# EasyEDA Pro project ProPrj_New Project_2026-07-15_23-14-34_2026-07-27.epro, board PCB1
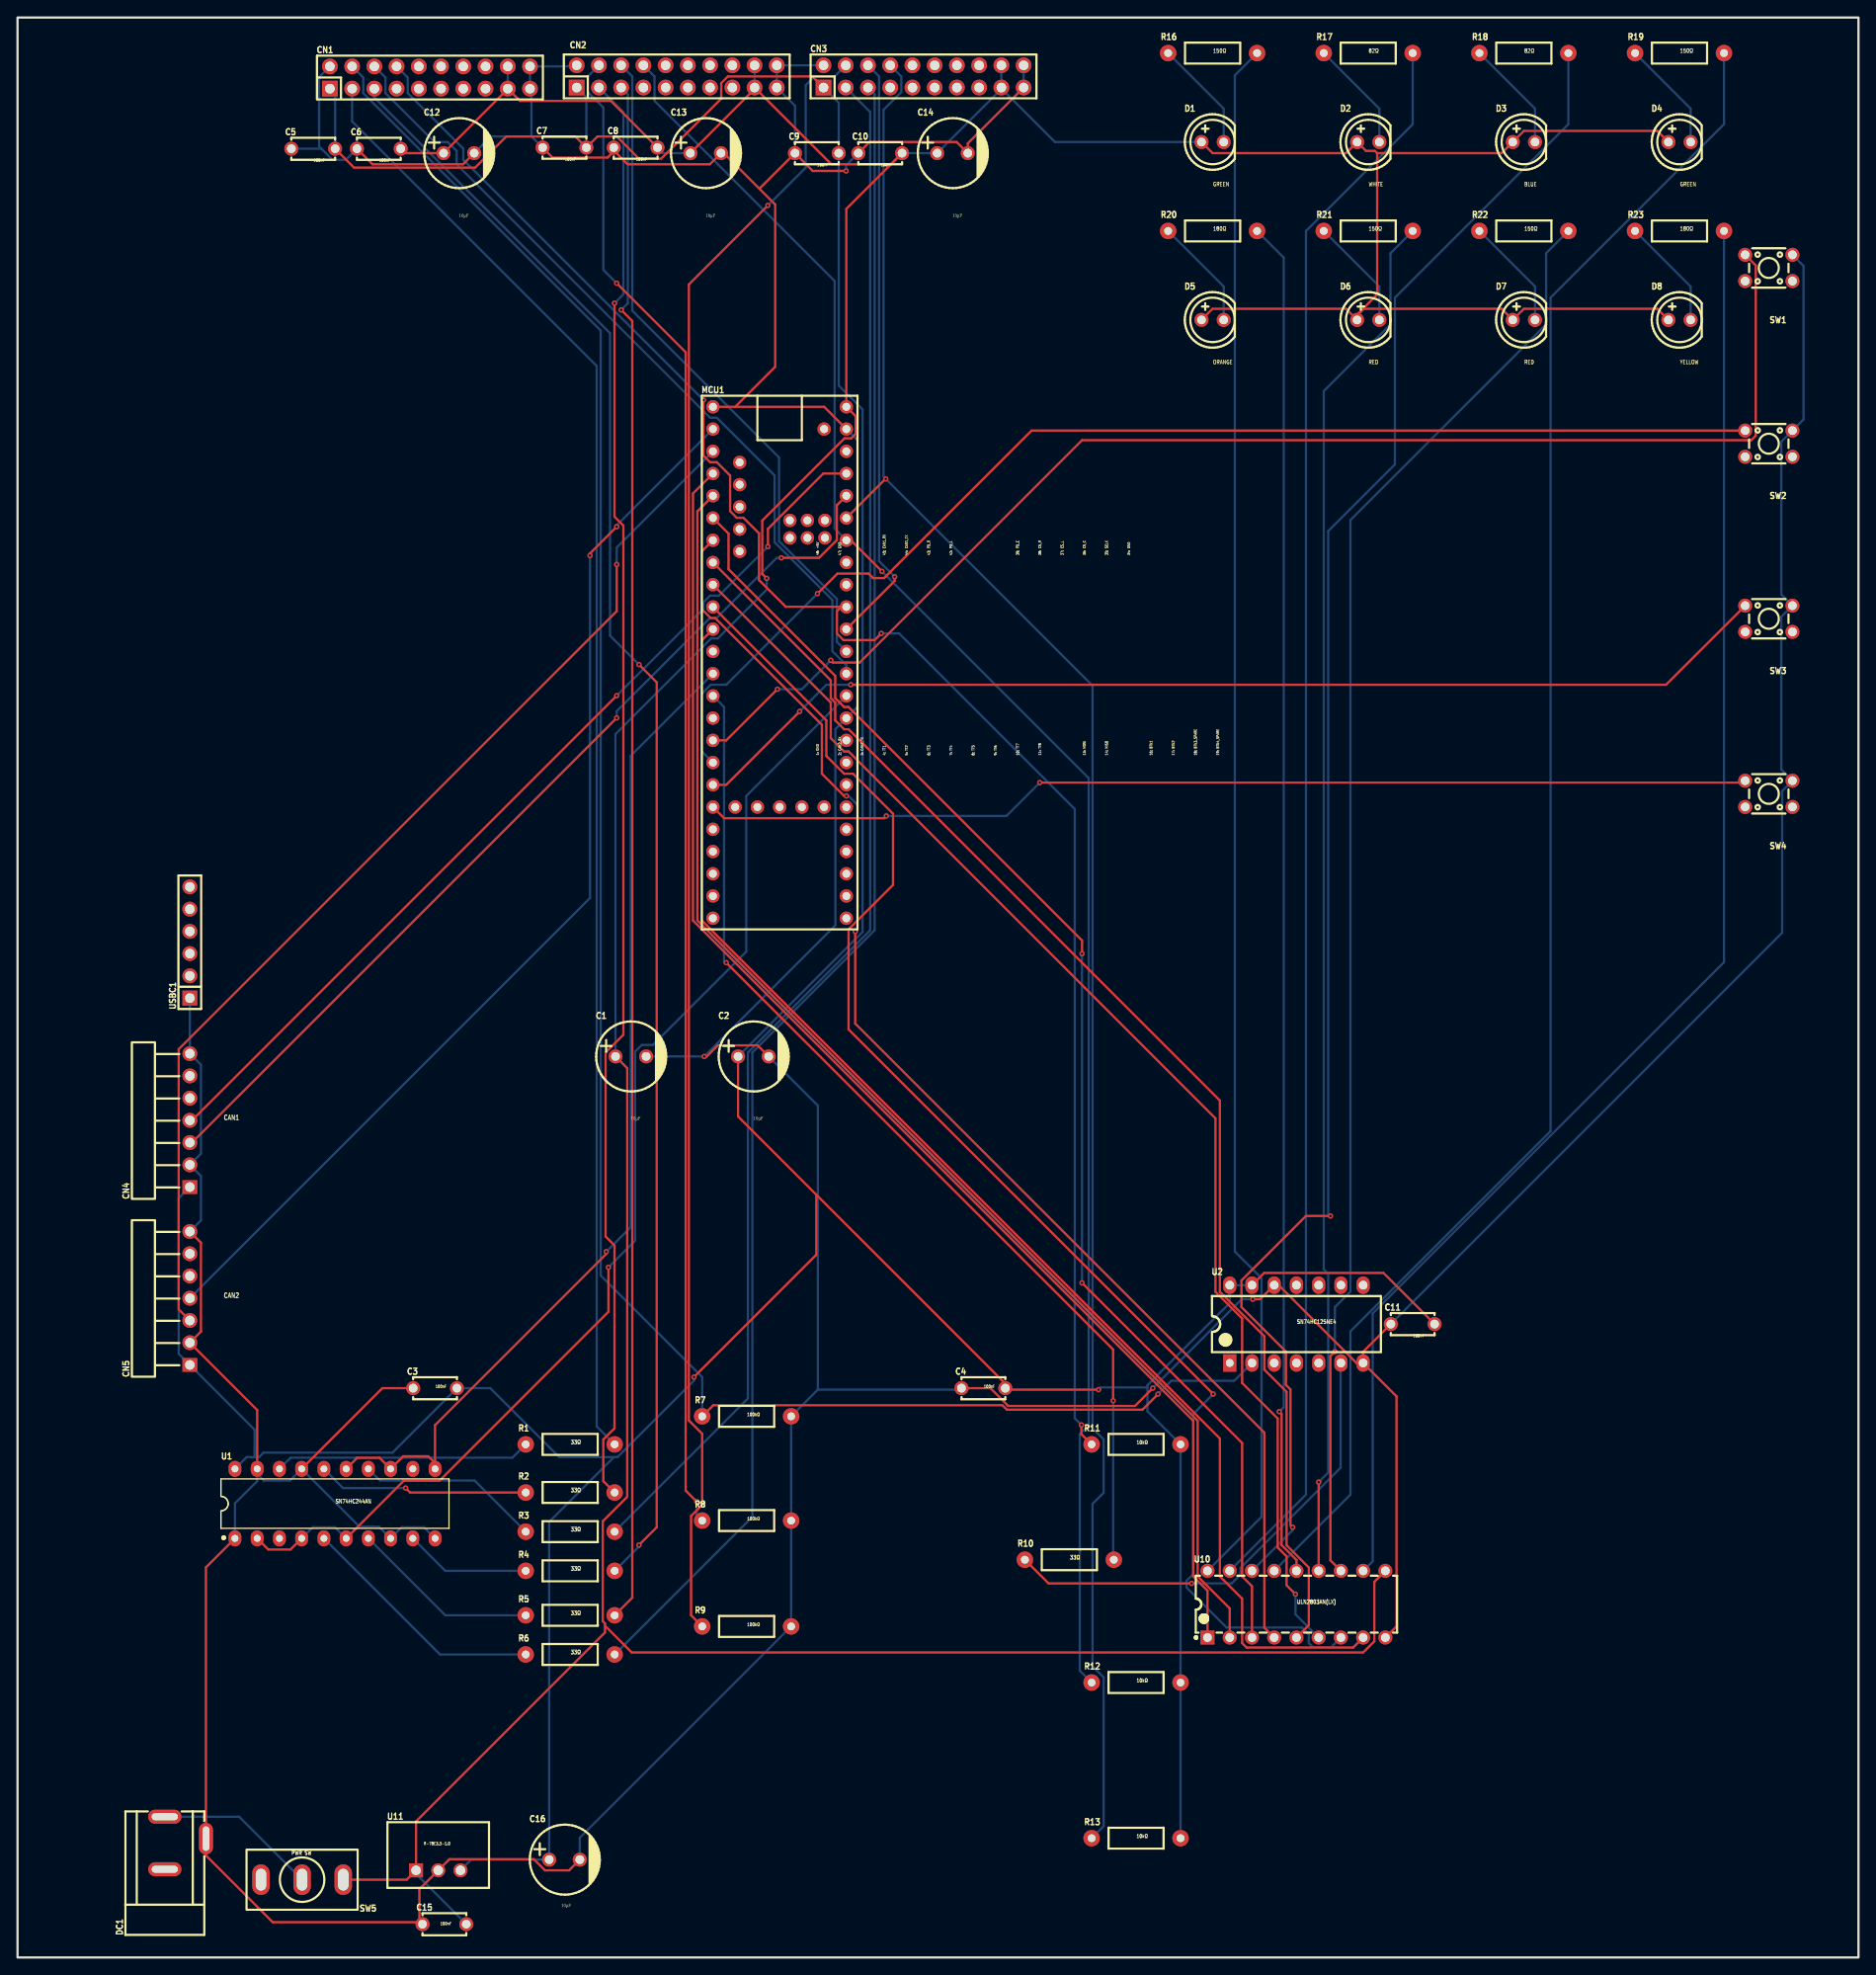
[diagram p7: board, top side]
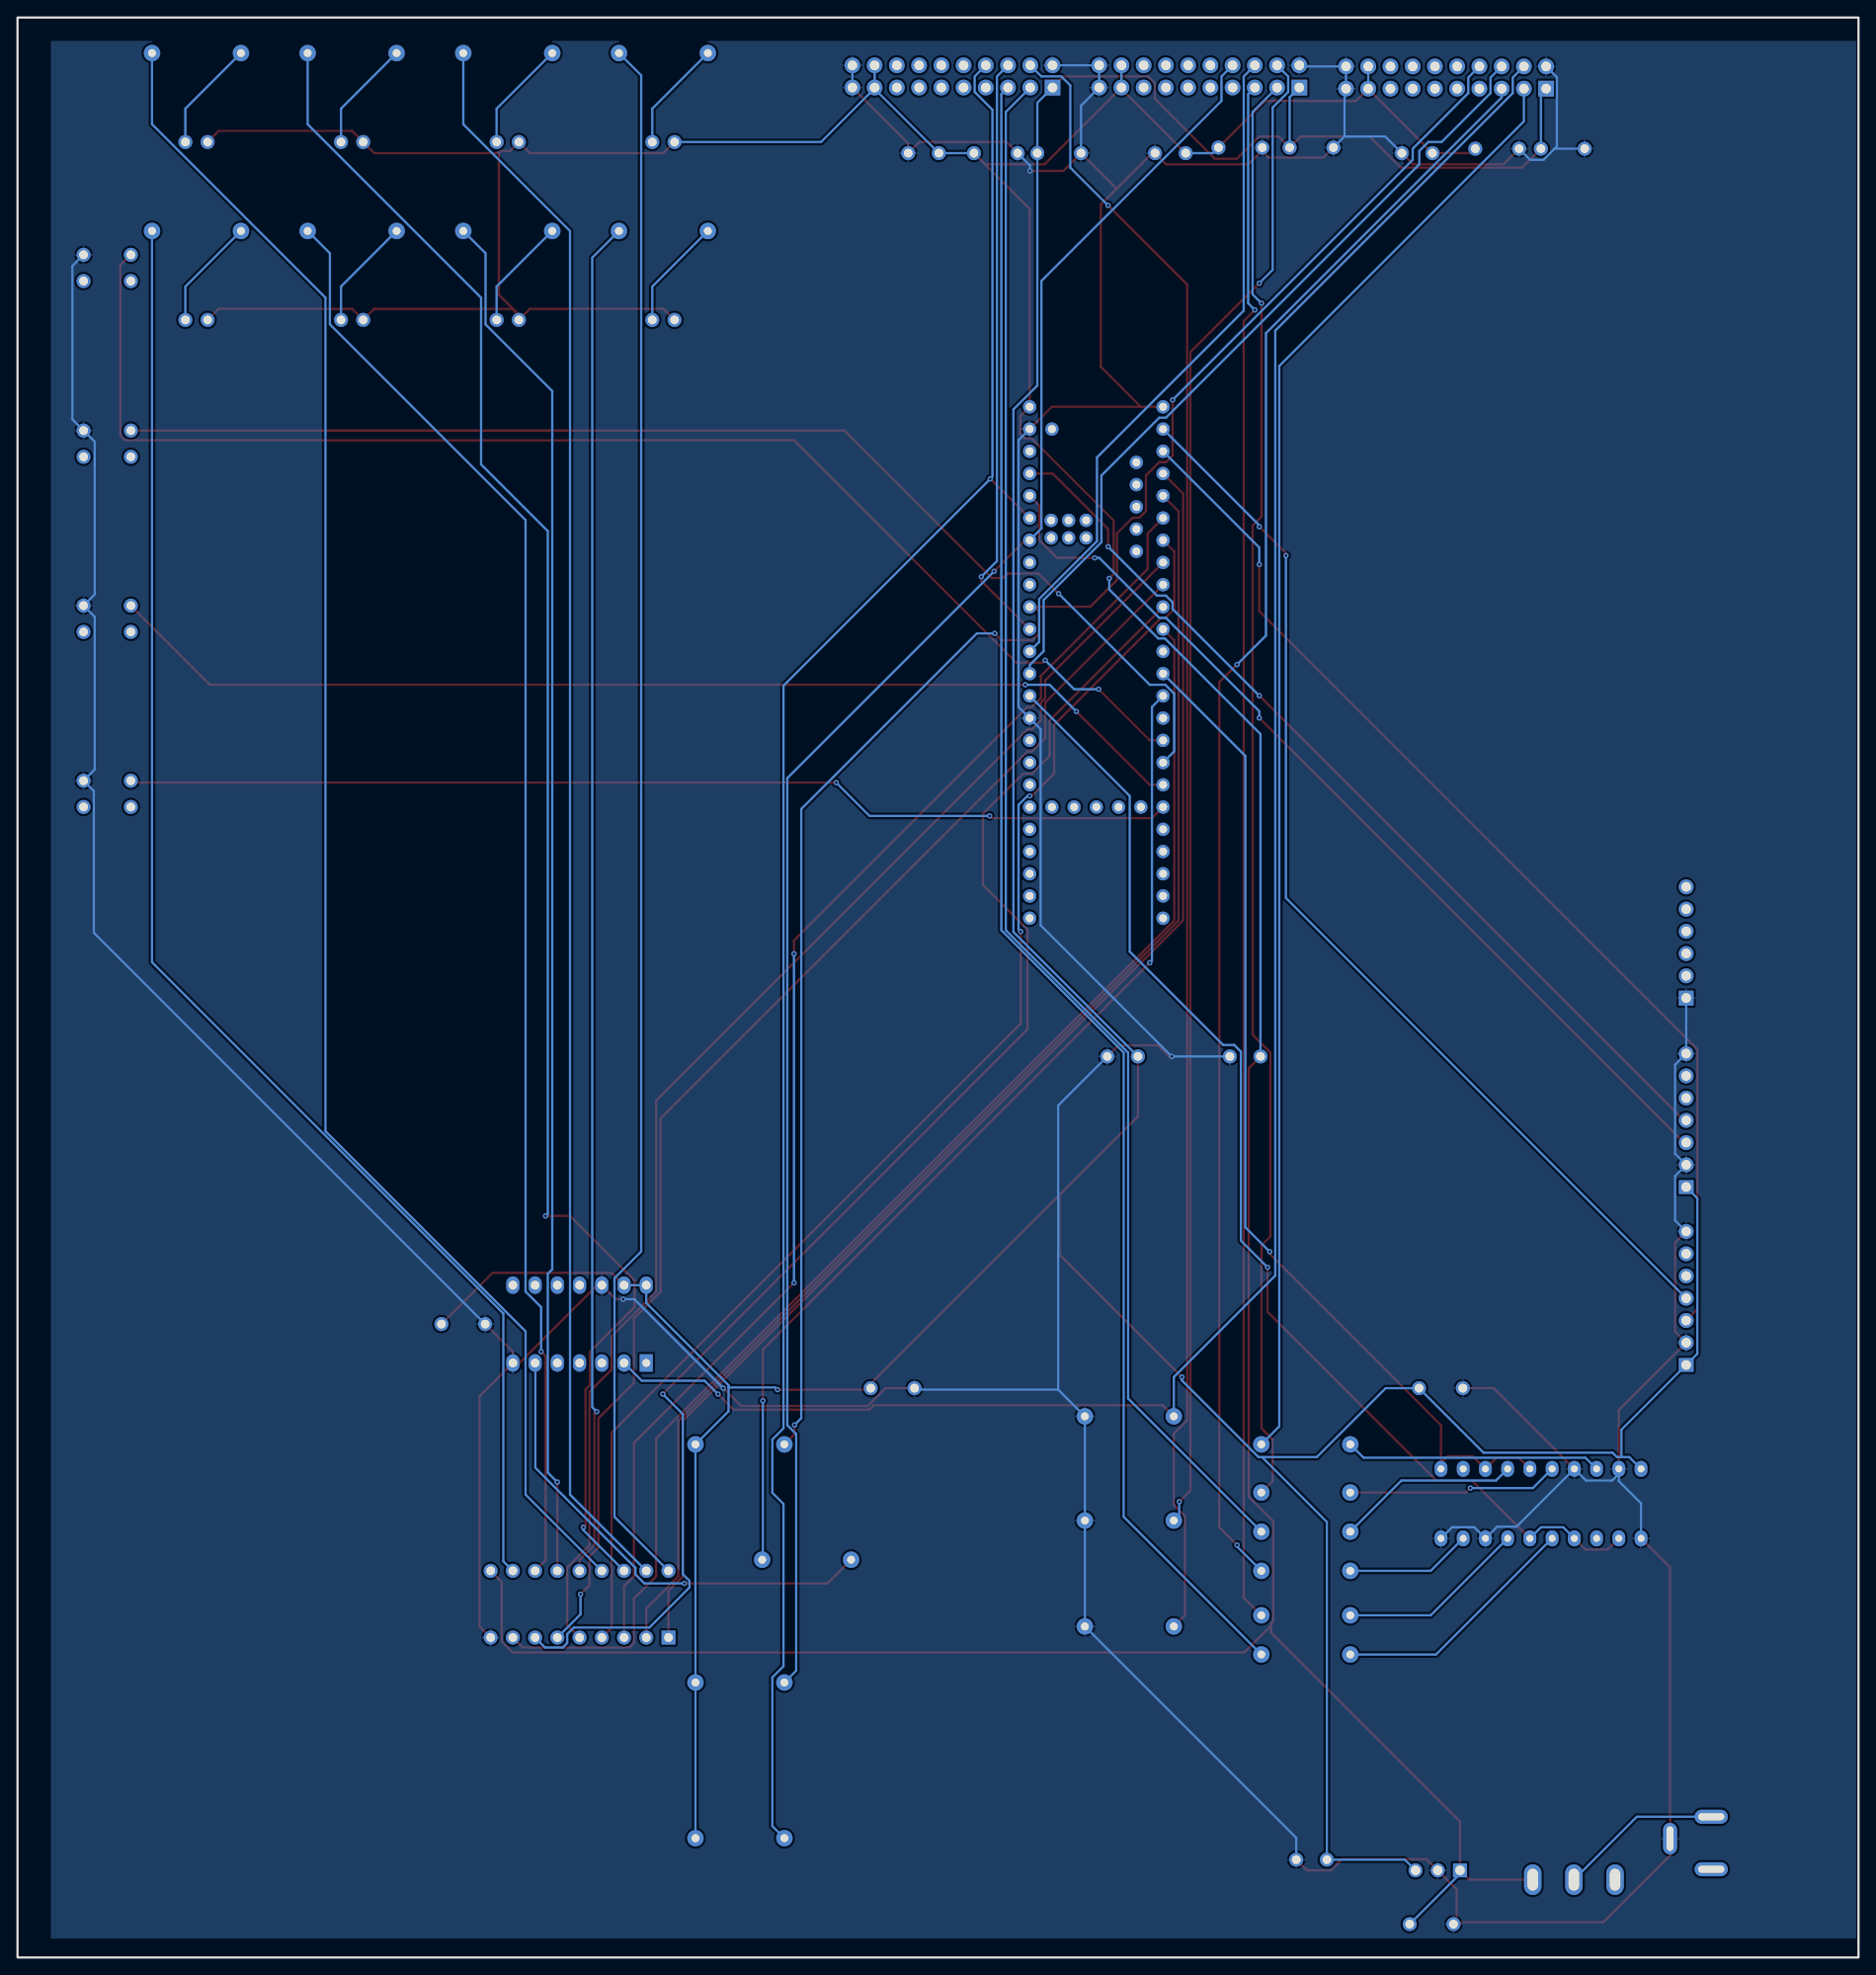
[diagram p8: board, bottom side, seen from below]

Outline 210.31 x 221.62 mm; copper layers: Top Layer, Bottom Layer. Coordinates in mm from the lower left corner of the outline.
Outline path: rectangle 0,221.62 210.31,0
Stack: Top Layer 0.035mm / Dielectric1 1.51mm FR4 er 4.5 / Bottom Layer 0.035mm

## Design rules (mm)
spacing copperThickness1oz (default): track to track 0.102, other pairs 0.152 to 0.3
spacing copperThickness2oz: track to track 0.203, other pairs 0.152 to 0.3
track width copperThickness1oz (default): min 0.127, default 0.254, max 2.54
track width copperThickness2oz: min 0.203, default 0.254, max 2.54
differential pair differentialPair (default): width min 0.127, default 0.254, max 2.54; gap min 0.152, default 0.152
net GND uses copperRegion

## Placement (name value [footprint] x y rotation side)
C1  10µF  [CAP-TH_BD8.0-P3.50-D0.6-FD]  70.06 102.93 0 top
C2  10µF  [CAP-TH_BD8.0-P3.50-D0.6-FD]  84.06 102.93 0 top
C3  100nF  [CAP-TH_L5.0-W2.5-P5.00-D1.0]  47.7 65.04 0 top
C4  100nF  [CAP-TH_L5.0-W2.5-P5.00-D1.0]  110.34 65.04 0 top
C5  100nF  [CAP-TH_L5.0-W2.5-P5.00-D1.0]  33.78 206.63 0 top
C6  100nF  [CAP-TH_L5.0-W2.5-P5.00-D1.0]  41.27 206.63 0 top
C7  100nF  [CAP-TH_L5.0-W2.5-P5.00-D1.0]  62.48 206.76 0 top
C8  100nF  [CAP-TH_L5.0-W2.5-P5.00-D1.0]  70.61 206.76 0 top
C9  100nF  [CAP-TH_L5.0-W2.5-P5.00-D1.0]  91.31 206.12 0 top
C10  100nF  [CAP-TH_L5.0-W2.5-P5.00-D1.0]  98.55 206.12 0 top
C11  100nF  [CAP-TH_L5.0-W2.5-P5.00-D1.0]  159.38 72.36 0 top
C12  10µF  [CAP-TH_BD8.0-P3.50-D0.6-FD]  50.42 206.12 0 top
C13  10µF  [CAP-TH_BD8.0-P3.50-D0.6-FD]  78.61 206.12 0 top
C14  10µF  [CAP-TH_BD8.0-P3.50-D0.6-FD]  106.81 206.12 0 top
C15  100nF  [CAP-TH_L5.0-W2.5-P5.00-D1.0]  48.77 3.81 0 top
C16  10µF  [CAP-TH_BD8.0-P3.50-D0.6-FD]  62.48 11.18 0 top
CN1  2.54-2*10P-CON20  [HDR-TH_20P-P2.54-V-F-R2-C10-S2.54]  47.12 214.76 0 top
CN2  2.54-2*10P-CON20  [HDR-TH_20P-P2.54-V-F-R2-C10-S2.54]  75.31 214.88 0 top
CN3  2.54-2*10P-CON20  [HDR-TH_20P-P2.54-V-F-R2-C10-S2.54]  103.5 214.88 0 top
CN4  1*7pin排间距2.54mm  [CONN-TH_7P-P2.54_C9900012194]  19.69 95.63 90 top
CN5  1*7pin排间距2.54mm  [CONN-TH_7P-P2.54_C9900012194]  19.69 75.31 90 top
D1  GREEN (left turn)  [LED-TH_BD5.0-P2.54-FD]  136.53 207.39 0 top
D2  WHITE (headlight)  [LED-TH_BD5.0-P2.54-FD]  154.31 207.39 0 top
D3  BLUE (high beam)  [LED-TH_BD5.0-P2.54-FD]  172.09 207.39 0 top
D4  GREEN (right turn)  [LED-TH_BD5.0-P2.54-FD]  189.87 207.39 0 top
D5  ORANGE (MIL/CEL)  [LED-TH_BD5.0-P2.54-FD]  136.53 187.07 0 top
D6  RED (parking brake)  [LED-TH_BD5.0-P2.54-FD]  154.31 187.07 0 top
D7  RED (oil)  [LED-TH_BD5.0-P2.54-FD]  172.09 187.07 0 top
D8  YELLOW (fog lights)  [LED-TH_BD5.0-P2.54-FD]  189.87 187.07 0 top
DC1  DC-005-5.5*2.5  [DC-IN-TH_DC-005-2]  19.18 13.08 90 top
MCU1  TEENSY41  [COMM-TH_L60.1-W17.8-P2.54]  87.06 147.93 0 top
R1  33Ω  [R_AXIAL-0.4]  63.14 58.62 0 top
R2  33Ω  [R_AXIAL-0.4]  63.14 53.12 0 top
R3  33Ω  [R_AXIAL-0.4]  63.14 48.64 0 top
R4  33Ω  [R_AXIAL-0.4]  63.14 44.17 0 top
R5  33Ω  [R_AXIAL-0.4]  63.14 39.09 0 top
R6  33Ω  [R_AXIAL-0.4]  63.14 34.62 0 top
R7  100kΩ  [R_AXIAL-0.4]  83.3 61.82 0 top
R8  100kΩ  [R_AXIAL-0.4]  83.3 49.91 0 top
R9  100kΩ  [R_AXIAL-0.4]  83.3 37.82 0 top
R10  33Ω  [R_AXIAL-0.4]  120.16 45.44 0 top
R11  10kΩ  [R_AXIAL-0.4]  127.78 58.62 0 top
R12  10kΩ  [R_AXIAL-0.4]  127.78 31.41 0 top
R13  10kΩ  [R_AXIAL-0.4]  127.78 13.63 0 top
R16  150Ω  [R_AXIAL-0.4]  136.53 217.55 0 top
R17  82Ω  [R_AXIAL-0.4]  154.31 217.55 0 top
R18  82Ω  [R_AXIAL-0.4]  172.09 217.55 0 top
R19  150Ω  [R_AXIAL-0.4]  189.87 217.55 0 top
R20  180Ω  [R_AXIAL-0.4]  136.53 197.23 0 top
R21  150Ω  [R_AXIAL-0.4]  154.31 197.23 0 top
R22  150Ω  [R_AXIAL-0.4]  172.09 197.23 0 top
R23  180Ω  [R_AXIAL-0.4]  189.87 197.23 0 top
SW1  TACT SW  [SW-TH_4P-L4.5-W4.5-P3.00-LS5.4]  200.07 193.01 0 top
SW2  TACT SW  [SW-TH_4P-L4.5-W4.5-P3.00-LS5.4]  200.07 172.93 0 top
SW3  TACT SW  [SW-TH_4P-L4.5-W4.5-P3.00-LS5.4]  200.07 152.93 0 top
SW4  TACT SW  [SW-TH_4P-L4.5-W4.5-P3.00-LS5.4]  200.07 132.93 0 top
SW5  100SP1T1B1M1QEH  [SW-TH_L12.7-W6.9-P4.70_TOGGLESWITCH7102]  32.51 8.89 180 top
U1  SN74HC244AN  [PDIP-20_L25.9-W6.6-P2.54-LS7.9-BL]  36.27 51.85 0 top
U2  SN74HC125NE4  [PDIP-14_L19.3-W6.4-P2.54-LS9.0-BL]  146.1 72.36 0 top
U10  ULN2803AN(LX)  [DIP-18_L23.0-W6.5-P2.54-LS7.6-BL]  146.1 40.36 0 top
U11  R-78E3.3-1.0  [PWRM-TH_R-78EXX-1.0]  48.06 9.96 0 top
USBC1  2.54-1*6-BLUE  [HDR-TH_6P-P2.54-V-M_BLUE]  19.69 115.95 90 top

## Footprints (pads in the part's own frame, mm; a bottom-side part is the same pattern mirrored in y, then rotated)
CAP-TH_BD8.0-P3.50-D0.6-FD
  round 1.6 hole 1: 1(-1.75,0) 2(1.75,0)
CAP-TH_L5.0-W2.5-P5.00-D1.0
  round 1.6 hole 1: 1(-2.5,0) 2(2.5,0)
COMM-TH_L60.1-W17.8-P2.54
  round 1.524 hole 0.914: 1(-7.62,29.21) 2(-7.62,26.67) 3(-7.62,24.13) 4(-7.62,21.59) 5(-7.62,19.05) 6(-7.62,16.51) 7(-7.62,13.97) 8(-7.62,11.43) 9(-7.62,8.89) 10(-7.62,6.35) 11(-7.62,3.81) 12(-7.62,1.27) 13(-7.62,-1.27) 14(-7.62,-3.81) 15(-7.62,-6.35) 16(-7.62,-8.89) 17(-7.62,-11.43) 18(-7.62,-13.97) 19(-7.62,-16.51) 20(-7.62,-19.05) 21(-7.62,-21.59) 22(-7.62,-24.13) 23(-7.62,-26.67) 24(-7.62,-29.21) 25(7.62,-29.21) 26(7.62,-26.67) 27(7.62,-24.13) 28(7.62,-21.59) 29(7.62,-19.05) 30(7.62,-16.51) 31(7.62,-13.97) 32(7.62,-11.43) 33(7.62,-8.89) 34(7.62,-6.35) 35(7.62,-3.81) 36(7.62,-1.27) 37(7.62,1.27) 38(7.62,3.81) 39(7.62,6.35) 40(7.62,8.89) 41(7.62,11.43) 42(7.62,13.97) 43(7.62,16.51) 44(7.62,19.05) 45(7.62,21.59) 46(7.62,24.13) 47(7.62,26.67) 48(7.62,29.21) 49(-4.57,22.86) 50(-4.57,20.32) 51(-4.57,17.78) 52(-4.57,15.24) 53(-4.57,12.7) 54(-5.08,-16.51) 55(-2.54,-16.51) 56(0,-16.51) 57(2.54,-16.51) 58(5.08,-16.51) 59(5.17,16.24) 60(5.17,14.24) 61(3.17,16.24) 62(3.17,14.24) 63(1.17,16.24) 64(1.17,14.24) 65(5.08,26.67)
CONN-TH_7P-P2.54_C9900012194
  rect 1.575x1.7 hole 1.1: 1(-7.62,0)
  round 1.7 hole 1.1: 2(-5.08,0) 3(-2.54,0) 4(0,0) 5(2.54,0) 6(5.08,0) 7(7.62,0)
DC-IN-TH_DC-005-2
  oval 1.6x3.8 hole 0.8x3: 1(2.999,2.35) 2(-3,2.35)
  oval 3.6x1.6 hole 2.8x0.8: 3(0.5,-2.35)
DIP-18_L23.0-W6.5-P2.54-LS7.6-BL
  rect 1.6x1.6 hole 1: 1(-10.16,-3.81)
  round 1.6 hole 1: 2(-7.62,-3.81) 3(-5.08,-3.81) 4(-2.54,-3.81) 5(0,-3.81) 6(2.54,-3.81) 7(5.08,-3.81) 8(7.62,-3.81) 9(10.16,-3.81) 10(10.16,3.81) 11(7.62,3.81) 12(5.08,3.81) 13(2.54,3.81) 14(0,3.81) 15(-2.54,3.81) 16(-5.08,3.81) 17(-7.62,3.81) 18(-10.16,3.81)
HDR-TH_6P-P2.54-V-M_BLUE
  rect 1.7x1.7 hole 1.1: 1(-6.35,0)
  round 1.7 hole 1.1: 2(-3.81,0) 3(-1.27,0) 4(1.27,0) 5(3.81,0) 6(6.35,0)
HDR-TH_20P-P2.54-V-F-R2-C10-S2.54
  rect 1.8x1.8 hole 1.1: 1(-11.43,-1.27)
  round 1.8 hole 1.1: 2(-11.43,1.27) 3(-8.89,-1.27) 4(-8.89,1.27) 5(-6.35,-1.27) 6(-6.35,1.27) 7(-3.81,-1.27) 8(-3.81,1.27) 9(-1.27,-1.27) 10(-1.27,1.27) 11(1.27,-1.27) 12(1.27,1.27) 13(3.81,-1.27) 14(3.81,1.27) 15(6.35,-1.27) 16(6.35,1.27) 17(8.89,-1.27) 18(8.89,1.27) 19(11.43,-1.27) 20(11.43,1.27)
LED-TH_BD5.0-P2.54-FD
  round 1.6 hole 1: 1(-1.27,0) 2(1.27,0)
PDIP-14_L19.3-W6.4-P2.54-LS9.0-BL
  rect 1.5x2 hole 0.9: 1(-7.62,-4.445)
  oval 1.5x2 hole 1: 2(-5.08,-4.445) 3(-2.54,-4.445) 4(0,-4.445) 5(2.54,-4.445) 6(5.08,-4.445) 7(7.62,-4.445) 8(7.62,4.445) 9(5.08,4.445) 10(2.54,4.445) 11(0,4.445) 12(-2.54,4.445) 13(-5.08,4.445) 14(-7.62,4.445)
PDIP-20_L25.9-W6.6-P2.54-LS7.9-BL
  oval 1.462x1.827 hole 0.8: 1(-11.43,-3.97) 2(-8.89,-3.97) 3(-6.35,-3.97) 4(-3.81,-3.97) 5(-1.27,-3.97) 6(1.27,-3.97) 7(3.81,-3.97) 8(6.35,-3.97) 9(8.89,-3.97) 10(11.43,-3.97) 11(11.43,3.97) 12(8.89,3.97) 13(6.35,3.97) 14(3.81,3.97) 15(1.27,3.97) 16(-1.27,3.97) 17(-3.81,3.97) 18(-6.35,3.97) 19(-8.89,3.97) 20(-11.43,3.97)
PWRM-TH_R-78EXX-1.0
  rect 1.6x1.6 hole 1.1: 1(-2.54,0)
  round 1.6 hole 1.1: 2(0,0) 3(2.54,0)
R_AXIAL-0.4
  round 1.879 hole 0.899: 1(-5.08,0) 2(5.08,0)
SW-TH_4P-L4.5-W4.5-P3.00-LS5.4
  round 1.6 hole 1: 1(-2.7,1.5) 2(2.7,1.5) 3(-2.7,-1.5) 4(2.7,-1.5)
SW-TH_L12.7-W6.9-P4.70_TOGGLESWITCH7102
  oval 2x3.5 hole 1.2x2.5: 1(-4.7,0) 2(0,0) 3(4.7,0)

## Nets
As in the schematic.

Pads without a net: CN1 7 9 10 11 12 13 14 15 16; CN2 7 9 10 11 12 13 14 15 16; CN3 7 9 10 11 12 13 14 15 16; DC1 2; MCU1 12 15 20 21 22 23 24 25 26 27 28 29 30 31 32 33 40 41 46 49 50 51 52 53 54 55 56 57 58 59 60 61 62 63 64 65; SW1 3 4; SW2 3 4; SW3 3 4; SW4 3 4; SW5 3; U1 3 12; U2 1 3 4 5 8 9 10 11

## Via types
v1: diameter 0.61, hole 0.305, Top Layer to Bottom Layer, 52 vias

## Routing (per net, layer and track width the routed paths; a pad name or vN(x,y) marks a point on that pad's centre or on a via; arc(x,y) is an arc through that point)
+3V3: length 545.4
  Top Layer w0.254: C11.2 156.04,78.2 142.42,78.2 U2.13 ; 91.25,87.14 91.25,80.28 v1(77.28,66.31) ; CN3.1 90.81,214.88 81.15,214.88 80.39,214.12 80.39,212.34 73.53,205.49 70.99,205.49 68.45,208.03 66.25,208.03 C7.2 63.71,208.03 55.84,208.03 52.28,204.47 38.44,204.47 C5.2 ; v1(123.5,64.87) 113.01,64.87 C4.2 112.84,65.55 82.31,96.07 C2.1
  Bottom Layer w0.254: C2.1 96.54,117.16 96.54,176.85 93.81,179.57 C9.2 93.81,211.88 CN3.1 ; CN2.1 64.98,212.51 C7.2 ; U2.13 U2.14 138.48,74.77 129.09,65.37 129.09,62.39 R11.2 R12.2 R13.2 ; 50.61,9.96 51.82,11.18 C16.1 60.73,49.76 68.14,57.16 ; C5.2 36.28,212.89 CN1.1 ; 129.09,65.12 123.75,65.12 v1(123.5,64.87) ; v1(77.28,66.31) 77.28,65.91 68.54,57.16 61.89,57.16 54.01,65.04 C3.2 42.83,57.67 28.1,57.67 27.59,57.16 26.19,57.16 U1.20 ; CN4.1 18.41,86.74 18.41,68.96 CN5.1 27.09,60.29 27.09,57.16
+5V: length 589.5
  Top Layer w0.254: C1.1 69.66,101.59 69.66,52.63 66.86,49.83 66.86,38.4 67.11,38.15 67.11,37.13 45.52,15.54 45.52,9.96 44.46,8.89 SW5.1 ; C8.2 67.78,212.09 57.4,212.09 CN1.17 56.01,213.46 C12.1 44.28,206.12 C6.2 ; 155.32,206.12 155.32,189.96 153.03,187.68 D6.1 151.76,188.34 136.53,188.34 D5.1 ; 155.32,206.12 155.07,206.38 154.05,206.38 D2.1 151.76,206.12 136.53,206.12 D1.1 ; 155.32,206.12 169.54,206.12 D3.1 172.09,208.66 187.32,208.66 D4.1 ; v1(85.59,157.54) 85.08,158.05 85.08,164.15 94.48,173.54 95.24,173.54 95.75,174.05 95.75,176.08 MCU1.48 94.69,199.75 C10.2 99.78,204.85 92.96,204.85 CN2.17 84.2,213.46 C13.1 ; U10.10 155,42.91 155,36.12 153.73,34.85 70.16,34.85 67.11,37.9 ; 153.03,187.58 153.8,188.34 169.54,188.34 D7.1 172.09,188.34 187.32,188.34 D8.1
  Bottom Layer w0.254: 112.42,213.49 C14.1 C10.2 ; 112.42,213.49 118.52,207.39 D1.1 ; 112.42,213.49 CN3.17 CN3.18 ; 45.52,9.96 45.52,9.55 C15.2 ; CN2.17 CN2.18 ; CN1.17 CN1.18 ; C1.1 68.31,139.76 79.24,150.68 80,150.68 85.59,156.27 v1(85.59,157.54) ; C13.1 73.75,206.12 C8.2
+5V_SW_IN: length 18.7
  Bottom Layer w0.254: DC1.1 25.32,16.08 SW5.2
GND: length 843.3
  Top Layer w0.254: 84.78,202.03 84.78,202.09 C9.1 90.84,204.09 v1(94.66,204.09) ; C12.2 50.9,204.85 40.55,204.85 C6.1 ; C11.1 153.72,69.2 U2.7 ; U2.7 152.96,67.91 144.07,76.8 U2.12 141.96,75.2 v1(141.12,75.2) ; U2.7 157.53,64.1 157.53,37.82 U10.9 ; U1.17 41.68,65.04 C3.1 ; C2.2 84.54,104.2 80,104.2 78.73,102.93 v1(78.45,102.93) ; 45.91,4.03 C15.1 ; 45.91,4.03 29.15,4.03 21.53,11.65 DC1.3 21.53,44.56 U1.1 ; 45.91,4.03 45.91,7.8 48.06,9.96 49.33,11.23 58.99,11.23 60.26,9.96 63.01,9.96 C16.2 ; 68.17,206.38 67.41,205.61 61.13,205.61 C7.1 ; 68.17,206.38 68.17,206.7 C8.1 ; 68.17,206.38 69.69,204.85 79.09,204.85 C13.2 80.69,206.12 86.56,200.26 86.56,181.71 81.98,177.14 ; U1.19 27.38,62.54 CN5.2 20.95,71.5 20.95,81.66 CN5.7 ; MCU1.1 92.15,177.14 MCU1.47 ; CN3.19 108.56,207.24 C14.2 107.29,207.39 97.32,207.39 C10.1 ; v1(129.69,65.04) 127.66,63.01 113.18,63.01 111.15,65.04 C4.1
  Bottom Layer w0.254: C1.2 v1(78.45,102.93) 93.44,117.92 93.44,140.33 MCU1.34 95.95,142.85 95.95,173.33 MCU1.47 ; v1(141.12,75.2) 139.85,75.2 v1(129.69,65.04) ; U1.1 24.84,51.88 27.38,54.42 U1.19 ; 27.38,55.24 28.14,54.48 31.12,54.48 U1.17 39.06,49.21 41.28,49.21 42.62,47.88 43.89,49.15 46.43,49.15 47.7,47.88 ; 58.71,208.03 58.71,213.32 CN1.19 CN1.20 63.75,216.03 CN2.2 ; 58.71,208.03 54.07,208.03 C12.2 ; 58.71,208.03 C7.1 ; 34.71,206.63 C5.1 ; 34.71,206.63 35.98,205.36 37.5,205.36 C6.1 ; 34.71,206.63 34.46,206.88 34.46,214.8 CN1.2 ; 91.42,64.87 91.42,97.32 C2.2 ; 91.42,64.87 R7.2 R8.2 R9.2 64.23,13.68 C16.2 ; 91.42,64.87 107.67,64.87 C4.1 ; USBC1.1 CN4.7 20.95,101.98 20.95,91.82 CN4.2 20.95,89.28 20.95,84.2 CN5.7 ; SW1.2 204.04,193.24 204.04,175.7 SW2.2 201.5,173.16 201.5,155.7 SW3.2 201.5,153.16 201.5,135.7 SW4.2 201.59,133.25 201.59,117.06 C11.1 ; v1(94.66,204.09) 94.66,204.72 C10.1 ; C9.1 88.81,211.54 CN2.19 CN2.20 CN3.2 ; CN3.19 CN3.20
BTN1: length 154.9
  Top Layer w0.254: v1(92.91,148.19) 93.16,147.93 96.21,147.93 121.61,173.33 198.06,173.33 198.57,173.84 198.57,193.3 SW1.1 ; v1(86.81,144.88) 80.97,139.04 MCU1.16
  Bottom Layer w0.254: v1(92.91,148.19) 89.6,144.88 v1(86.81,144.88)
BTN2: length 140.5
  Top Layer w0.254: SW2.1 115.85,174.43 99,157.58 97.73,157.58 97.22,158.09 93.67,158.09 v1(91.38,155.81)
  Bottom Layer w0.254: MCU1.17 78.17,137.77 78.17,144.38 79.19,145.39 80.97,145.39 v1(91.38,155.81)
BTN3_SPARE: length 126.4
  Top Layer w0.254: SW3.1 188.33,145.39 v1(95.19,145.39) ; v1(89.35,142.34) 80.97,133.96 MCU1.18
  Bottom Layer w0.254: v1(89.35,142.34) 92.4,145.39 v1(95.19,145.39)
BTN4_SPARE: length 120.2
  Top Layer w0.254: MCU1.19 80.72,130.15 99,130.15 v1(99.26,130.41) ; v1(116.78,134.22) 197.15,134.22 SW4.1
  Bottom Layer w0.254: v1(116.78,134.22) 112.97,130.41 v1(99.26,130.41)
CAN1_RX: length 107.2
  Top Layer w0.254: CN4.4 19.94,95.63 v1(68.45,144.15) ; MCU1.45 92.05,169.52 85.72,163.2 v1(85.72,161.16)
  Bottom Layer w0.254: v1(68.45,144.15) 78.36,154.05 78.36,154.81 79.12,155.58 80.14,155.58 v1(85.72,161.16)
CAN1_TX: length 108.4
  Top Layer w0.254: v1(68.45,141.61) 19.94,93.09 CN4.3 ; v1(87.25,159.89) 91.57,159.89 93.6,161.93 93.6,165.9 MCU1.44
  Bottom Layer w0.254: v1(68.45,141.61) 68.45,142.37 79.12,153.04 79.88,153.04 86.74,159.89 v1(87.25,159.89)
CAN2_RX: length 124
  Top Layer w0.254: v1(65.41,160.15) 65.41,160.4 v1(68.45,163.45)
  Bottom Layer w0.254: MCU1.2 68.45,163.61 v1(68.45,163.45) ; CN5.4 65.41,121.03 v1(65.41,160.15)
CAN2_TX: length 125.1
  Top Layer w0.254: v1(68.45,159.13) 68.45,153.8 18.41,103.76 18.41,74.04 CN5.3
  Bottom Layer w0.254: v1(68.45,159.13) 68.45,161.07 MCU1.3
CS_C: length 93
  Bottom Layer w0.254: MCU1.36 94.69,147.63 93.09,149.23 93.09,155.07 86.49,161.67 86.49,169.29 79.88,175.9 79.12,175.9 50.16,204.85 50.16,206.38 49.15,207.39 47.62,207.39 42.04,212.98 42.04,214.76 CN1.6
CS_L: length 77.6
  Bottom Layer w0.254: CN2.6 70.23,214.88 70.23,188.12 87,171.36 87,161.8 93.6,155.19 93.6,150.29 MCU1.37
CS_R: length 68
  Top Layer w0.254: MCU1.38 100.2,157.26 v1(100.2,157.73)
  Bottom Layer w0.254: CN3.6 98.43,214.88 98.43,159.51 v1(100.2,157.73)
MISO: length 117.7
  Top Layer w0.254: v1(125.16,63.6) 125.16,69.45 v1(80.97,113.64)
  Bottom Layer w0.254: R10.2 125.16,45.52 v1(125.16,63.6) ; MCU1.14 80.72,142.85 80.72,113.9 v1(80.97,113.64)
MISO_C: length 236.5
  Top Layer w0.254: v1(130.29,64.36) 128.51,62.58 113.01,62.58 112.51,63.09 79.49,63.09 R7.1
  Bottom Layer w0.254: U2.2 138.99,65.88 131.81,65.88 v1(130.29,64.36) ; R7.1 78.22,66.31 66.62,77.9 66.62,185.85 39.5,212.98 39.5,214.76 CN1.4
MISO_L: length 172.2
  Top Layer w0.254: v1(68.45,191.26) 76.33,183.39 76.33,53.34 v1(77.6,52.07)
  Bottom Layer w0.254: v1(77.6,52.07) 77.6,50.53 R8.1 ; v1(68.45,191.26) 66.93,192.79 66.93,211.33 65.15,213.11 65.15,214.88 CN2.4
MISO_NODE: length 55.1
  Top Layer w0.254: v1(134.13,42.74) 117.79,42.74 R10.1
  Bottom Layer w0.254: U2.6 151.15,67.88 151.15,55.94 139.72,44.51 139.72,43.75 138.7,42.74 v1(134.13,42.74)
MISO_R: length 188.8
  Top Layer w0.254: v1(85.72,200.15) 76.69,191.12 76.69,61.36 78.22,59.83 78.22,51.71 76.95,50.44 76.95,39.09 R9.1
  Bottom Layer w0.254: CN3.4 93.34,214.88 91.06,214.88 90.04,213.87 90.04,204.47 v1(85.72,200.15)
MOSI: length 116.1
  Top Layer w0.254: 47.69,56.49 46.93,57.25 44.05,57.25 42.62,55.82 41.35,57.09 38.81,57.09 U1.15 ; v1(67.25,80.62) 67.25,80.37 47.69,60.81 47.69,55.82
  Bottom Layer w0.254: v1(67.25,80.62) 70.05,83.42 70.05,137.26 MCU1.13
MOSI_C: length 184.7
  Top Layer w0.254: v1(70.99,147.7) 73.02,145.67 73.02,49.15 v1(70.99,47.12)
  Bottom Layer w0.254: CN1.5 40.77,212.47 67.69,185.55 67.69,151 v1(70.99,147.7) ; R4.2 70.99,46.95 v1(70.99,47.12)
MOSI_C_PRE: length 14.4
  Bottom Layer w0.254: R4.1 48.87,44.17 U1.9
MOSI_L: length 176.5
  Top Layer w0.254: v1(68.96,188.21) 70.23,186.94 70.23,41.1 R5.2
  Bottom Layer w0.254: v1(68.96,188.21) 69.72,188.98 69.72,212.85 CN2.5
MOSI_L_PRE: length 21.6
  Bottom Layer w0.254: R5.1 48.87,39.09 U1.7
MOSI_R: length 191.6
  Bottom Layer w0.254: CN3.5 97.92,212.85 97.92,117.35 83.95,103.38 83.95,50.35 R6.2
MOSI_R_PRE: length 28.6
  Bottom Layer w0.254: R6.1 48.26,34.62 U1.5
PD_C: length 200.7
  Top Layer w0.254: R11.1 121.54,59.78 v1(121.54,60.83) ; v1(98.68,151.26) 97.92,150.5 94.36,150.5 93.6,151.26 93.6,153.8 94.11,154.31 ; v1(78.36,177.93) 78.36,171.58 79.12,170.81 79.88,170.81 81.41,169.29 81.41,165.23 82.17,164.47 82.93,164.47 84.71,162.69 84.71,157.35 87.76,154.31 94.66,154.31 MCU1.39
  Bottom Layer w0.254: v1(78.36,177.93) 50.93,205.36 50.93,206.63 44.58,212.98 44.58,214.76 CN1.8 ; v1(98.68,151.26) 100.71,151.26 120.78,131.19 120.78,61.6 v1(121.54,60.83)
PD_L: length 207.1
  Top Layer w0.254: MCU1.42 95.19,161.9 v1(98.75,158.35)
  Bottom Layer w0.254: v1(98.75,158.35) 122.37,134.72 122.37,60.81 121.35,59.79 121.35,32.76 R12.1 ; CN2.8 72.77,214.88 72.77,212.09 93.34,191.52 93.34,163.24 MCU1.42
PD_R: length 222.3
  Top Layer w0.254: MCU1.43 99.15,168.91 v1(99.19,168.91)
  Bottom Layer w0.254: CN3.8 100.97,214.88 100.97,213.11 98.93,211.07 98.93,169.16 v1(99.19,168.91) 122.81,145.29 122.81,60.45 124.08,59.18 124.08,53.09 122.81,51.82 122.81,33.27 124.08,32 124.08,15.01 R13.1
SCLK: length 135.3
  Top Layer w0.254: U1.2 28.65,46.61 31.19,46.61 U1.4 ; U1.6 44.12,54.46 48.2,54.46 67.51,73.76 v1(67.51,78.84)
  Bottom Layer w0.254: U1.6 36.27,49.15 33.73,49.15 U1.4 ; MCU1.35 83.25,132.69 83.25,114.91 72.59,104.24 71.32,104.24 70.55,103.48 70.55,81.89 v1(67.51,78.84)
SCLK_C: length 167.3
  Bottom Layer w0.254: R1.2 66.17,60.67 66.17,181.8 38.23,209.74 CN1.3
SCLK_C_PRE: length 29.3
  Bottom Layer w0.254: U1.18 31.19,57.09 56.53,57.09 R1.1
SCLK_L: length 164.8
  Top Layer w0.254: v1(68.2,188.98) 68.2,164.59 69.22,163.58 69.22,105.41 67.18,103.38 67.18,82.36 68.2,81.35 68.2,60.45 66.93,59.18 66.93,54.41 R2.2
  Bottom Layer w0.254: CN2.3 69.22,210.82 69.22,189.99 v1(68.2,188.98)
SCLK_L_PRE: length 24.2
  Top Layer w0.254: v1(44.34,53.63) 44.85,53.12 R2.1
  Bottom Layer w0.254: U1.16 37.19,53.63 v1(44.34,53.63)
SCLK_R: length 178.2
  Bottom Layer w0.254: R3.2 83.44,63.87 83.44,103.38 97.41,117.35 97.41,210.82 CN3.3
SCLK_R_PRE: length 20.9
  Bottom Layer w0.254: R3.1 52.22,54.49 41.41,54.49 U1.14
TT1: length 158.3
  Top Layer w0.254: MCU1.4 77.16,167.24 77.16,118.47 134.31,61.32 134.31,43.54 135.94,41.9 U10.1
TT1_LED_K: length 12.8
  Bottom Layer w0.254: R16.1 137.79,211.2 D1.2
TT1_OUT: length 178.3
  Bottom Layer w0.254: U10.18 142.11,50.34 142.11,77.6 139.06,80.65 139.06,215.01 R16.2
TT2: length 156.4
  Top Layer w0.254: U10.2 138.48,39.87 134.82,43.54 134.82,61.32 77.67,118.47 77.67,165.2 MCU1.5
TT2_LED_K: length 12.8
  Bottom Layer w0.254: R17.1 155.57,211.2 D2.2
TT2_OUT: length 182
  Bottom Layer w0.254: R17.2 159.38,209.42 147.19,197.23 147.19,52.88 U10.17
TT3: length 153.7
  Top Layer w0.254: v1(121.61,77.06) 139.9,58.78 139.9,43.54 141.02,42.41 U10.3 ; MCU1.6 81.22,162.66 81.22,158.6 93.41,146.41 93.41,143.87 94.43,142.85 94.94,142.85 121.61,116.18 v1(121.61,114.66)
  Bottom Layer w0.254: v1(121.61,114.66) v1(121.61,77.06)
TT3_LED_K: length 12.8
  Bottom Layer w0.254: R18.1 173.35,211.2 D3.2
TT3_OUT: length 195
  Top Layer w0.254: v1(145.67,49.15) 145.41,49.4 145.41,64.9 144.91,65.41 144.91,69.22 139.83,74.3 139.83,77.34 147.19,84.71 v1(149.99,84.71)
  Bottom Layer w0.254: v1(149.99,84.71) 149.73,84.96 149.73,162.94 157.35,170.56 157.35,189.61 177.16,209.42 R18.2 ; U10.16 145.67,48.82 v1(145.67,49.15)
TT4: length 153.8
  Top Layer w0.254: v1(94.69,132.69) 94.43,132.69 91.89,135.23 91.89,140.82 79.7,153.01 79.19,153.01 78.17,154.03 78.17,160.63 MCU1.7 ; v1(95.7,117.2) 95.7,106.69 142.44,59.95 142.44,37.68 U10.4
  Bottom Layer w0.254: v1(94.69,132.69) 94.94,132.69 95.95,131.68 95.95,117.45 v1(95.7,117.2)
TT4_LED_K: length 12.8
  Bottom Layer w0.254: R19.1 191.13,211.2 D4.2
TT4_OUT: length 194.7
  Bottom Layer w0.254: R19.2 194.94,209.42 175.13,189.61 175.13,94.39 152.27,71.53 152.27,52.88 U10.15
TT5: length 151.9
  Top Layer w0.254: U10.5 147.52,37.96 147.52,44.55 144.98,47.09 144.98,64.62 142.44,67.16 142.44,70.97 137.36,76.05 137.36,97.89 94.94,140.31 94.43,140.31 93.41,141.33 93.41,143.36 92.91,143.87 92.91,145.9 MCU1.8
TT5_LED_K: length 12.8
  Bottom Layer w0.254: D5.2 137.79,190.88 R20.1
TT5_OUT: length 155.3
  Top Layer w0.254: v1(144.15,62.36) 144.4,62.1 144.4,47.12 146.1,45.41 U10.14
  Bottom Layer w0.254: R20.2 144.65,194.18 144.65,62.87 v1(144.15,62.36)
TT6: length 149.2
  Top Layer w0.254: MCU1.9 92.91,143.36 92.91,139.3 94.43,137.77 94.94,137.77 136.85,95.86 136.85,76.05 139.9,73 139.9,65.64 143.96,61.57 143.96,46.84 144.98,45.82 144.98,42.52 v1(145.99,41.51)
  Bottom Layer w0.254: v1(145.99,41.51) 145.99,39.2 U10.6
TT6_LED_K: length 12.8
  Bottom Layer w0.254: R21.1 155.57,190.88 D6.2
TT6_OUT: length 157.9
  Top Layer w0.254: v1(148.64,54.3) U10.13
  Bottom Layer w0.254: R21.2 156.84,194.69 156.84,186.56 149.22,178.94 149.22,78.61 149.73,78.11 149.73,55.39 v1(148.64,54.3)
TT7: length 163.3
  Top Layer w0.254: v1(136.59,64.37) 94.94,106.02 94.94,117.45 100.02,122.53 100.02,130.66 95.45,135.23 94.43,135.23 92.4,137.26 92.4,141.33 MCU1.10
  Bottom Layer w0.254: U10.7 150.04,35.41 148.03,35.41 147.52,35.92 147.52,36.93 146.75,37.7 138.12,37.7 133.55,42.27 133.55,43.03 134.31,43.79 134.31,62.08 v1(136.59,64.37)
TT7_LED_K: length 12.8
  Bottom Layer w0.254: R22.1 173.35,190.88 D7.2
TT7_OUT: length 164.8
  Top Layer w0.254: U10.12 149.99,45.37 149.99,68.71 v1(150.5,69.22)
  Bottom Layer w0.254: R22.2 174.62,194.69 174.62,186.56 152.27,164.21 152.27,76.07 150.5,74.3 v1(150.5,69.22)
TT8: length 156.4
  Top Layer w0.254: MCU1.11 78.17,150.47 78.17,118.47 137.36,59.29 137.36,43.54 139.9,41 139.9,35.92 140.41,35.41 152.58,35.41 U10.8
TT8_LED_K: length 12.8
  Bottom Layer w0.254: D8.2 191.13,190.88 R23.1
TT8_OUT: length 170.1
  Bottom Layer w0.254: R23.2 194.94,113.7 154.81,73.56 154.81,45.26 U10.11

## Copper pours and planes (outline as drawn; the poured copper is in the pictures)
GND on Bottom Layer: 0.25,218.95 206.5,218.95 206.5,2.16 0.25,2.16

## Text on the board
Top Silkscreen Layer: 48: +5V | 1: GND | 47: GND | 2: CAN2_RX | 3: CAN2_TX | 45: CAN1_RX | 4: TT1 | 44: CAN1_TX | 5: TT2 | 43: PD_R | 6: TT3 | 42: PD_L | 7: TT4 | 8: TT5 | 9: TT6 | 39: PD_C | 10: TT7 | 38: CS_R | 11: TT8 | 37: CS_L | 36: CS_C | 13: MOSI | 35: SCLK | 14: MISO | 34: GND | 16: BTN1 | 17: BTN2 | 18: BTN3_SPARE | 19: BTN4_SPARE | 100nF | R-78E3.3-1.0 | 100kΩ | 10kΩ | 150Ω | GREEN | 180Ω | ORANGE | 82Ω | WHITE | RED | BLUE | YELLOW | PWR SW | SN74HC244AN | 33Ω | SN74HC125NE4 | ULN2803AN(LX) | CAN1 | CAN2 | 10µF
